# Altium schematic sheet Instrumentacao.SchDoc
size A4
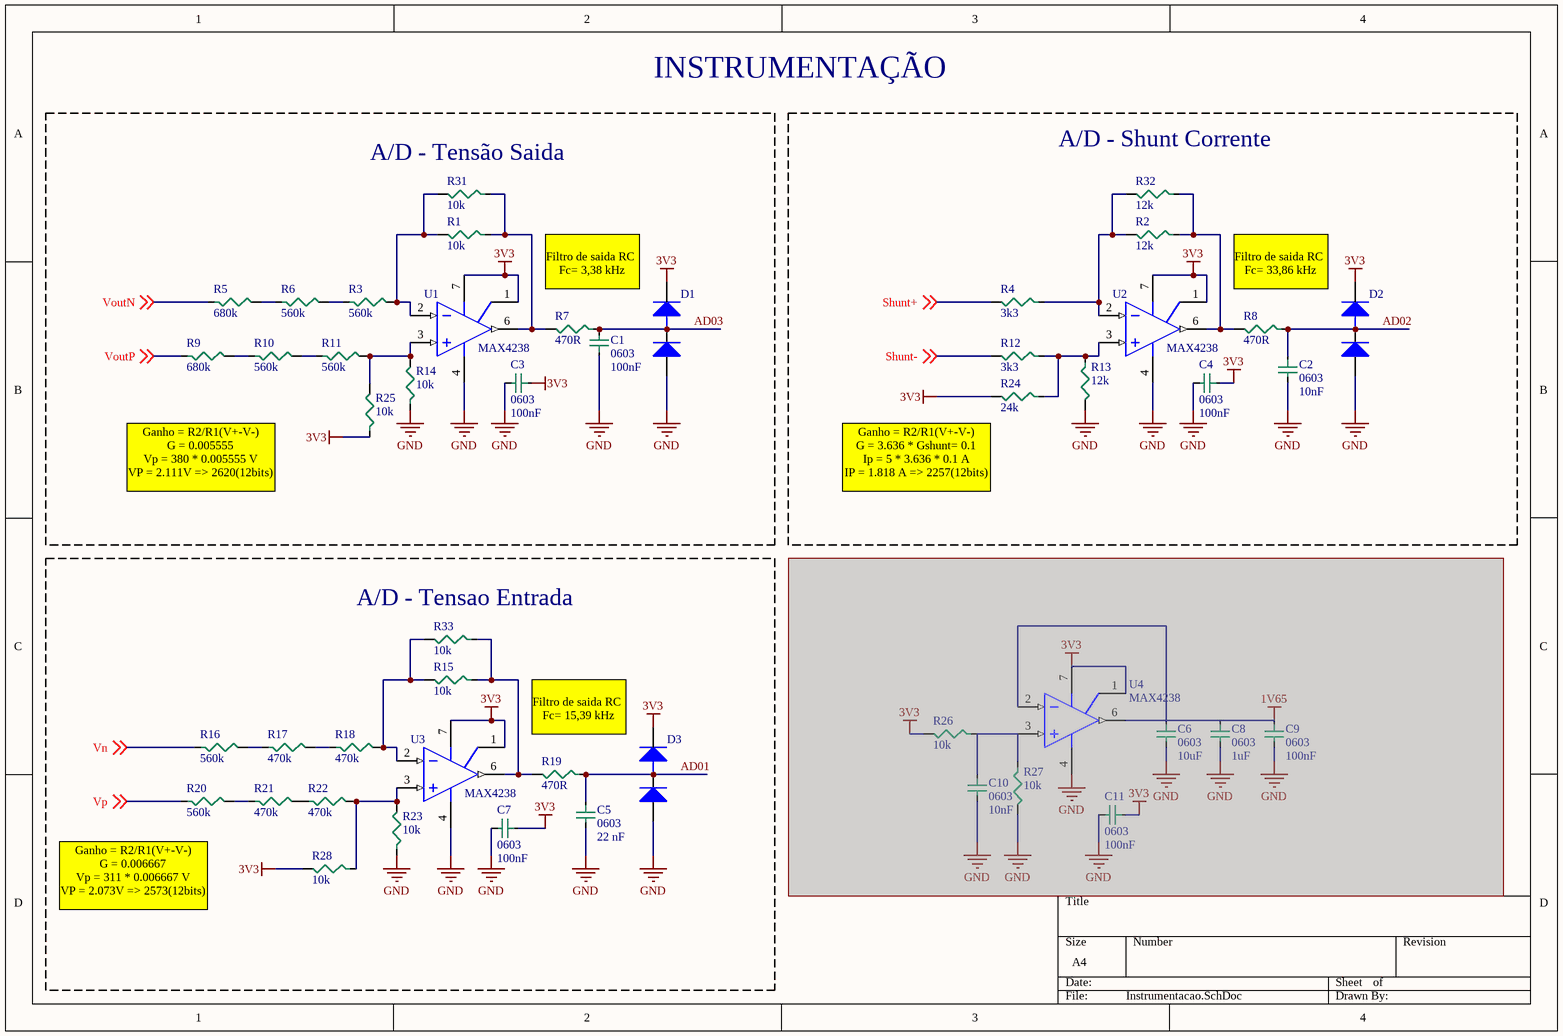
[diagram p0: Instrumentacao.SchDoc]

## Parts
C1  0603  value 100nF  [0603C]
C2  0603  value 10nF  [0603C]
C3  0603  value 100nF  [0603C]
C4  0603  value 100nF  [0603C]
C5  0603  value 22 nF  [0603C]
C6  0603  value 10uF  [0603C]  (masked out: inside a compile mask, not in the netlist)
C7  0603  value 100nF  [0603C]
C8  0603  value 1uF  [0603C]  (masked out: inside a compile mask, not in the netlist)
C9  0603  value 100nF  [0603C]  (masked out: inside a compile mask, not in the netlist)
C10  0603  value 10nF  [0603C]  (masked out: inside a compile mask, not in the netlist)
C11  0603  value 100nF  [0603C]  (masked out: inside a compile mask, not in the netlist)
D1  BAT54S  [SOT23]  (value not drawn)
D2  BAT54S  [SOT23]  (value not drawn)
D3  BAT54S  [SOT23]  (value not drawn)
R1  value 10k  [0603]  (hidden comment: 0603)
R2  value 12k  [0603]  (hidden comment: 0603)
R3  value 560k  [0603]  (hidden comment: 0603)
R4  value 3k3  [0603]  (hidden comment: 0603)
R5  value 680k  [0603]  (hidden comment: 0603)
R6  value 560k  [0603]  (hidden comment: 0603)
R7  value 470R  [0603]  (hidden comment: 0603)
R8  value 470R  [0603]  (hidden comment: 0603)
R9  value 680k  [0603]  (hidden comment: 0603)
R10  value 560k  [0603]  (hidden comment: 0603)
R11  value 560k  [0603]  (hidden comment: 0603)
R12  value 3k3  [0603]  (hidden comment: 0603)
R13  value 12k  [0603]  (hidden comment: 0603)
R14  value 10k  [0603]  (hidden comment: 0603)
R15  value 10k  [0603]  (hidden comment: 0603)
R16  value 560k  [0603]  (hidden comment: 0603)
R17  value 470k  [0603]  (hidden comment: 0603)
R18  value 470k  [0603]  (hidden comment: 0603)
R19  value 470R  [0603]  (hidden comment: 0603)
R20  value 560k  [0603]  (hidden comment: 0603)
R21  value 470k  [0603]  (hidden comment: 0603)
R22  value 470k  [0603]  (hidden comment: 0603)
R23  value 10k  [0603]  (hidden comment: 0603)
R24  value 24k  [0603]  (hidden comment: 0603)
R25  value 10k  [0603]  (hidden comment: 0603)
R26  value 10k  [0603]  (hidden comment: 0603)  (masked out: inside a compile mask, not in the netlist)
R27  value 10k  [0603]  (hidden comment: 0603)  (masked out: inside a compile mask, not in the netlist)
R28  value 10k  [0603]  (hidden comment: 0603)
R31  value 10k  [0603]  (hidden comment: 0603)
R32  value 12k  [0603]  (hidden comment: 0603)
R33  value 10k  [0603]  (hidden comment: 0603)
U1  MAX4238  [SOIC8]
U2  MAX4238  [SOIC8]
U3  MAX4238  [SOIC8]
U4  MAX4238  [SOIC8]  (masked out: inside a compile mask, not in the netlist)

## Blocks framed on the sheet
A/D - Tensão Saida: C1 C3 D1 R1 R3 R5-R7 R9-R11 R14 R25 R31 U1
A/D - Shunt Corrente: C2 C4 D2 R2 R4 R8 R12 R13 R24 R32 U2
A/D - Tensao Entrada: C5 C7 D3 R15-R23 R28 R33 U3

## Nets
3V3: C3.1 C4.1 C7.1 D1.2(K) D2.2(K) D3.2(K) R24.2 R25.1 R28.2 U1.1(BAL) U1.7(V+) U2.1(BAL) U2.7(V+) U3.1(BAL) U3.7(V+)
GND: C1.1 C2.2 C3.2 C4.2 C5.2 C7.2 D1.1(A) D2.1(A) D3.1(A) R13.2 R14.1 R23.1 U1.4(V-) U2.4(V-) U3.4(V-)
AD01: C5.1 D3.3(M) R19.1
AD02: C2.1 D2.3(M) R8.1
AD03: C1.2 D1.3(M) R7.1
Shunt+: R4.2 ; off-sheet Shunt+
Shunt-: R12.2 ; off-sheet Shunt-
Vn: R16.1 ; off-sheet Vn
VoutN: R5.1 ; off-sheet VoutN
VoutP: R9.1 ; off-sheet VoutP
Vp: R20.1 ; off-sheet Vp
NetR1_1: R1.1 R7.2 R31.1 U1.6(OUT)
NetR1_2: R1.2 R3.2 R31.2 U1.2(IN-)
NetR2_1: R2.1 R8.2 R32.1 U2.6(OUT)
NetR2_2: R2.2 R4.1 R32.2 U2.2(IN-)
NetR3_1: R3.1 R6.2
NetR5_2: R5.2 R6.1
NetR9_2: R9.2 R10.1
NetR10_2: R10.2 R11.1
NetR11_2: R11.2 R14.2 R25.2 U1.3(IN+)
NetR12_1: R12.1 R13.1 R24.1 U2.3(IN+)
NetR15_1: R15.1 R19.2 R33.1 U3.6(OUT)
NetR15_2: R15.2 R18.2 R33.2 U3.2(IN-)
NetR16_2: R16.2 R17.1
NetR17_2: R17.2 R18.1
NetR20_2: R20.2 R21.1
NetR21_2: R21.2 R22.1
NetR22_2: R22.2 R23.2 R28.1 U3.3(IN+)

## Notes on the sheet
- INSTRUMENTAÇÃO
- Filtro de saida RC
  Fc= 3,38 kHz
- Filtro de saida RC
  Fc= 33,86 kHz
- Ganho = R2/R1(V+-V-)
  G = 0.005555
  Vp = 380 * 0.005555 V
  VP = 2.111V => 2620(12bits)
- (near R24) Ganho = R2/R1(V+-V-)
  G = 3.636 * Gshunt= 0.1
  Ip = 5 * 3.636 * 0.1 A
  IP = 1.818 A => 2257(12bits)
- Filtro de saida RC
  Fc= 15,39 kHz
- (near R20) Ganho = R2/R1(V+-V-)
  G = 0.006667
  Vp = 311 * 0.006667 V
  VP = 2.073V => 2573(12bits)

## Library data of the parts
C1-C11 = Capacitor SMD 0603
D1-D3 = BAT54SFSCT-ND: DIODE SCHOTTKY 20V 0.5A SOD123; Supplier 1: Digi-Key; Supplier Part Number 1: BAT54SFSCT-ND
R1-R28 R31-R33 = Resistor SMD 0603 1/10 W: %: ±1%; P: 1/8W
U1-U4 = MAX4238: IC OPAMP GP 1MHZ RRO 8SOIC; Supplier 1: Digi-Key; Supplier Part Number 1: MAX4238ASA+-ND